# Altium schematic sheet Protection.SchDoc
size 420 x 297 mm; Address1: Address1; Address2: Address2; Address3: Address3; Address4: Address4; DocumentNumber: *Э3; SheetNumber: 9; SheetTotal: 11; DocumentType: Схема электрическая *
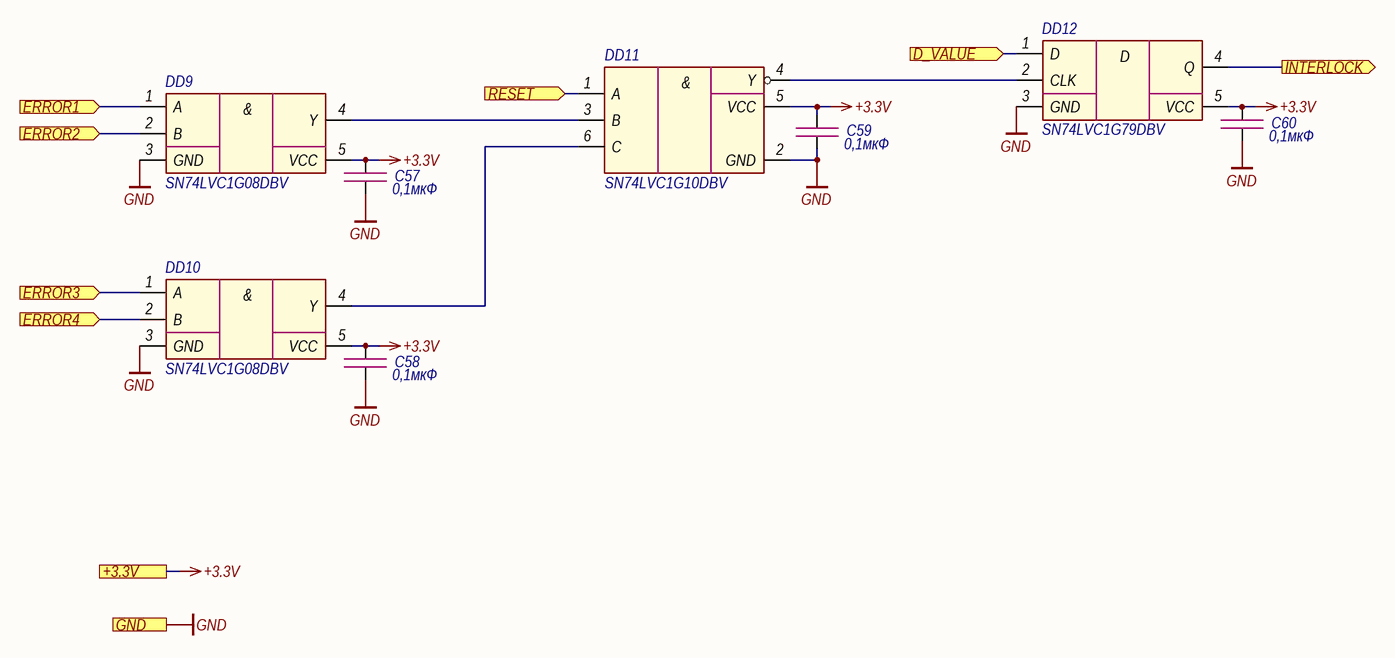
[diagram p0: Protection.SchDoc]

## Parts
C57  0,1мкФ  [CAP_0603]
C58  0,1мкФ  [CAP_0603]
C59  0,1мкФ  [CAP_0603]
C60  0,1мкФ  [CAP_0603]
DD9  SN74LVC1G08DBV  [SOT-23-5]
DD10  SN74LVC1G08DBV  [SOT-23-5]
DD11  SN74LVC1G10DBV  [SOT-23-6]
DD12  SN74LVC1G79DBV  [SOT-23-5]

## Ports
+3.3V (see Main[2B], Ethernet[3D], Fiber_interlock[2C], Hardwiring[3D], LD_driver[1D], Power_supply[2D]), D_VALUE (in, see Main[2B]), ERROR1 (in, see Main[2B]), ERROR2 (in, see Main[2B]), ERROR3 (in, see Main[2B]), ERROR4 (in, see Main[2B]), GND (see Main[2B], Ethernet[3D], Fiber_interlock[2C], Guide_laser[1C], Hardwiring[3D], Indication[1C], LD_driver[1D], Power_supply[2D]), INTERLOCK (out, see Main[2B], LD_driver[1A], Power_supply[1A]), RESET (in, see Main[2B])

## Nets
+3.3V: C57.1 C58.1 C59.1 C60.1 DD9.5(VCC) DD10.5(VCC) DD11.5(VCC) DD12.5(VCC) ; port +3.3V
GND: C57.2 C58.2 C59.2 C60.2 DD9.3(GND) DD10.3(GND) DD11.2(GND) DD12.3(GND) ; port GND
D_VALUE: DD12.1(D) ; port D_VALUE
ERROR1: DD9.1(A) ; port ERROR1
ERROR2: DD9.2(B) ; port ERROR2
ERROR3: DD10.1(A) ; port ERROR3
ERROR4: DD10.2(B) ; port ERROR4
INTERLOCK: DD12.4(Q) ; port INTERLOCK
RESET: DD11.1(A) ; port RESET
NetDD9_4: DD9.4(Y) DD11.3(B)
NetDD10_4: DD10.4(Y) DD11.6(C)
NetDD11_4: DD11.4(Y) DD12.2(CLK)

## Notes on the sheet
- Подп. и дата
- Инв. № дубл.
- Взам. инв. №
- Инв. № подл.
- Изм.
- Лист
- № докум.
- Подп.
- Дата
- Копировал
- Формат А3
- (in symbol SN74LVC1G08) &
- (in symbol SN74LVC1G10) &

## Library data of the parts
C57-C60 = Capacitor: Manufacturer: Murata; Model: GRM188R71H104KA93D; Value: 0,1мкФ; Document: *
DD9 DD10 = SN74LVC1G08: Manufacturer: Texas Instruments; Model: SN74LVC1G08DBV; Document: *
DD11 = SN74LVC1G10: Manufacturer: Texas Instruments; Model: SN74LVC1G10DBV; Document: *
DD12 = SN74LVC1G79: Manufacturer: Texas Instruments; Model: SN74LVC1G79DBV; Document: *